# Altium project Staravia.PrjPcb
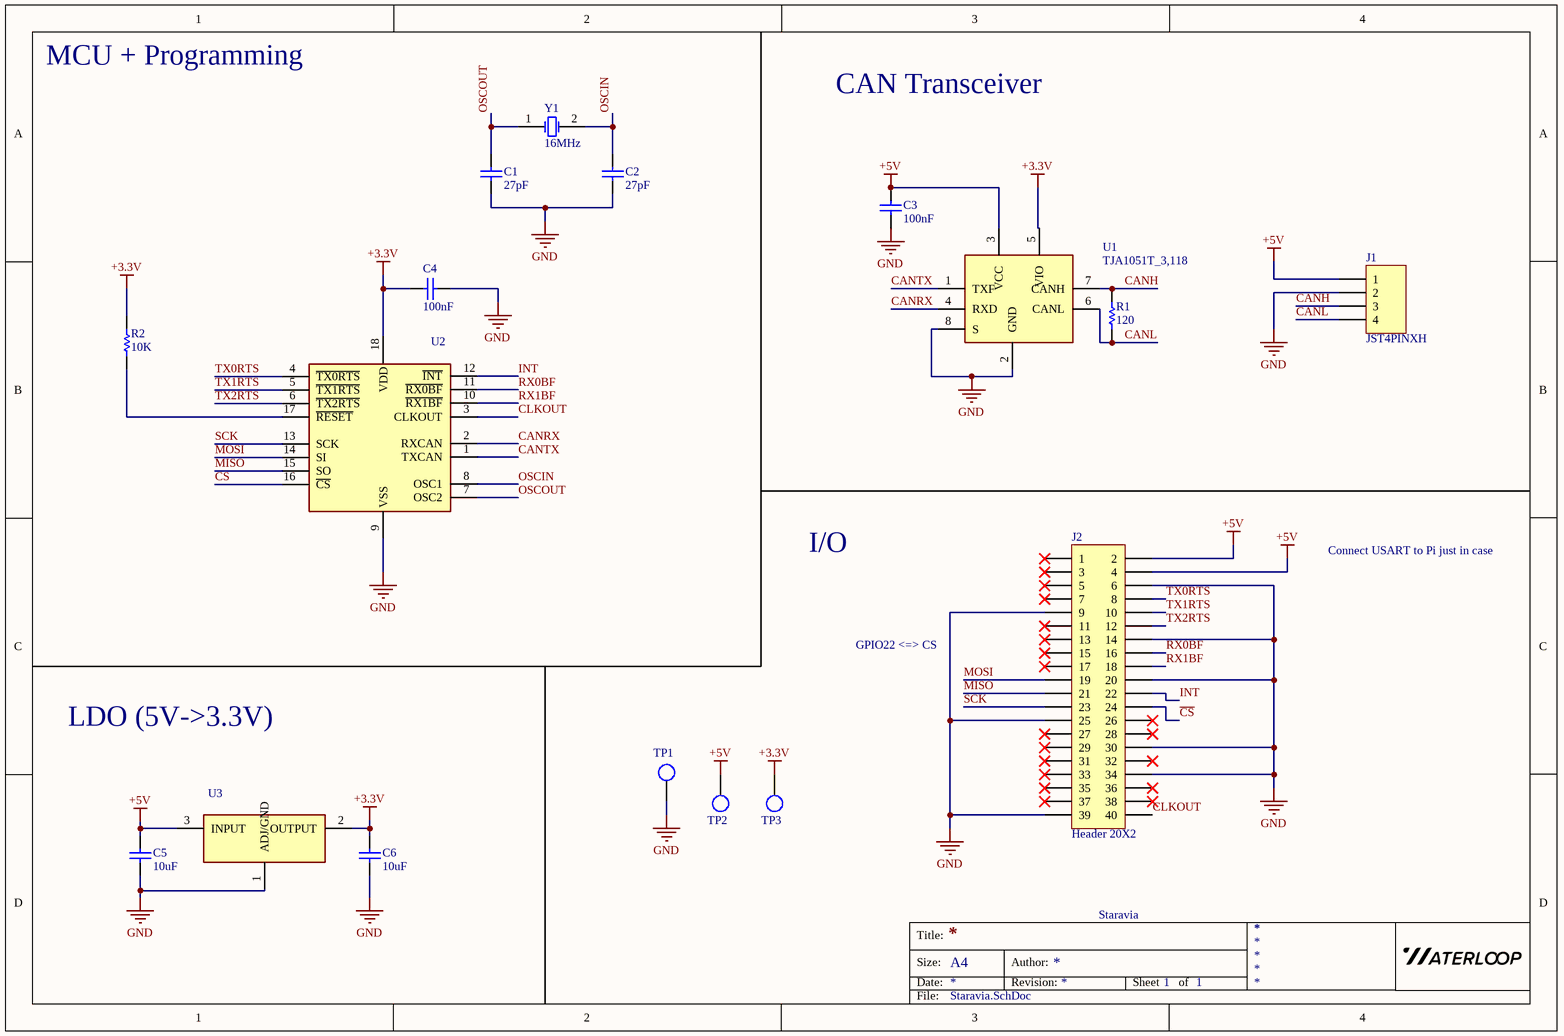
[diagram p0: Staravia.SchDoc]
1 sheet, 17 parts. Net scope: global (net labels, ports and power ports of the same name join across sheets).
Board file: Staravia.PcbDoc

## Sheet Staravia.SchDoc
size A4; SheetNumber: 1; SheetTotal: 1

### Parts
C1  value 27pF  [0805 - Capacitor]  (hidden comment: Capacitor - Nonpolarized)
C2  value 27pF  [0805 - Capacitor]  (hidden comment: Capacitor - Nonpolarized)
C3  value 100nF  [0805 - Capacitor]  (hidden comment: Capacitor - Nonpolarized)
C4  value 100nF  [0805 - Capacitor]  (hidden comment: Capacitor - Nonpolarized)
C5  value 10uF  [0805 - Capacitor]  (hidden comment: Capacitor - Nonpolarized)
C6  value 10uF  [0805 - Capacitor]  (hidden comment: Capacitor - Nonpolarized)
J1  JST4PINXH  [B4B-XH]  (no BOM)
J2  Header 20X2  [HDR2X20]  (no BOM)
R1  value 120  [0603 - Resistor]  (hidden comment: Resistor)
R2  value 10K  [0603 - Resistor]  (hidden comment: Resistor)
TP1  Test Point  [Test Point]  (value not drawn)  (no BOM)
TP2  Test Point  [Test Point]  (value not drawn)  (no BOM)
TP3  Test Point  [Test Point]  (value not drawn)  (no BOM)
U1  TJA1051T_3,118  [TJA1051T/3,118]  (no BOM)
U2  MCP2515-E/SO  [MCP2515-I/ML]  (value not drawn)
U3  TLV1117-33IDCYR  [TLV1117]  (value not drawn)  (no BOM)
Y1  value 16MHz  [2-SMD NO LEAD CRSYSTAL]  (hidden comment: Oscillator)

### Nets
+3.3V: C4.2 C6.2 R2.2 TP3.1 U1.5(VIO) U2.18(VDD) U3.2(OUTPUT)
+5V: C3.2 C5.1 J1.1 J2.2 J2.4 TP2.1 U1.3(VCC) U3.3(INPUT)
GND: C1.1 C2.1 C3.1 C4.1 C5.2 C6.1 J1.2 J2.6 J2.9 J2.14 J2.20 J2.25 J2.30 J2.34 J2.39 TP1.1 U1.2(GND) U1.8(S) U2.9(VSS) U3.1(ADJ/GND)
~{CS}: J2.24 U2.16(~{CS})
CANH: J1.3 R1.2 U1.7(CANH)
CANL: J1.4 R1.1 U1.6(CANL)
CANRX: U1.4(RXD) U2.2(RXCAN)
CANTX: U1.1(TXF) U2.1(TXCAN)
CLKOUT: J2.40 U2.3(CLKOUT)
INT: J2.22 U2.12(~{INT})
MISO: J2.21 U2.15(SO)
MOSI: J2.19 U2.14(SI)
OSCIN: C2.2 U2.8(OSC1) Y1.2(OSC2)
OSCOUT: C1.2 U2.7(OSC2) Y1.1(OSC1)
RX0BF: J2.16 U2.11(~{RX0BF})
RX1BF: J2.18 U2.10(~{RX1BF})
SCK: J2.23 U2.13(SCK)
TX0RTS: J2.8 U2.4(~{TX0RTS})
TX1RTS: J2.10 U2.5(~{TX1RTS})
TX2RTS: J2.12 U2.6(~{TX2RTS})
NetR2_1: R2.1 U2.17(~{RESET})

Not connected (* = marked no-connect by the designer): J2 1* 3* 5* 7* 11* 13* 15* 17* 26* 27* 28* 29* 31* 32* 33* 35* 36* 37* 38*

### Notes on the sheet
- MCU + Programming
- CAN Transceiver
- I/O
- Connect USART to Pi just in case
- GPIO22 <=> CS
- LDO (5V->3.3V)
- Staravia
- Title:
- Size:
- Date:
- A4
- Author:
- Revision:
- Sheet
- of
- File:

### Library data of the parts
C1 C2 = Capacitor - Nonpolarized: Nonpolarized Capacitor; Manufacturer: Yageo; Manufacturer Part Number: CC0805JRNPO9BN270; Supplier Part Number: 311-1104-1-ND; Supplier: Digikey; Rating: *
C3 C4 = Capacitor - Nonpolarized: Nonpolarized Capacitor; Manufacturer: Yageo; Manufacturer Part Number: CC0805KRX7R8BB104; Supplier Part Number: 311-1141-1-ND; Supplier: Digikey; Rating: *
C5 C6 = Capacitor - Nonpolarized: Nonpolarized Capacitor; Manufacturer: Yageo; Manufacturer Part Number: CC0805KFX7R6BB106; Supplier Part Number: 13-CC0805KFX7R6BB106CT-ND; Supplier: Digikey; Rating: *
J1 = 1x4 Header: 1x4 Pin Header
J2 = Header 20X2: Header, 20-Pin, Dual row; LatestRevisionDate: 17-Jul-2002; LatestRevisionNote: Re-released for DXP Platform.; Publisher: Altium Limited
R1 = Resistor: Manufacturer Part Number: RC0603FR-07120RL; Manufacturer: Yageo; Supplier Part Number: 311-120HRCT-ND; Supplier: Digikey
R2 = Resistor: Manufacturer Part Number: RC0603FR-0710KL; Manufacturer: Yageo; Rating: *; Supplier Part Number: 311-10.0KHRCT-ND; Supplier: Digikey
U1 = TJA1051T_3,118: CAN Transceiver IC 4.5V-5.5V 250ns; Manufacturer: NXP; Datasheet: http://www.nxp.com/docs/en/data-sheet/TJA1051.pdf; Manufacturer Part Number: TJA1051T/3,118; Supplier Part Number: 568-8684-1-ND; Supplier: Digikey; ComponentLink1Description: Datasheet; ComponentLink1URL: http://www.nxp.com/docs/en/data-sheet/TJA1051.pdf
U2 = MCP2515-E/SO: SPI->CAN Controller; Manufacturer: Microchip; Manufacturer Part Number: MCP2515-E/SO; Supplier Part Number: MCP2515-E/SO-ND; Supplier: Digikey; ComponentLink1Description: Datasheet; ComponentLink1URL: https://ww1.microchip.com/downloads/en/DeviceDoc/MCP2515-Stand-Alone-CAN-Controller-with-SPI-20001801J.pdf
U3 = TLV1117-33IDCYR: Linear Voltage Regulator IC 3.3V 800MA SOT223-4; Manufacturer: Texas Instruments; Manufacturer Part Number: TLV1117-33IDCYR; Supplier Part Number: 296-21112-1-ND; Supplier: Digikey; ComponentLink1Description: Datasheet; ComponentLink1URL: http://www.ti.com/lit/ds/symlink/tlv1117.pdf?HQS=TI-null-null-digikeymode-df-pf-null-wwe&ts=1590668900314
Y1 = Oscillator: Crystal Oscillator; Manufacturer Part Number: ABM7-16.000MHZ-4-T; Manufacturer: Abracon LLC; Supplier Part Number: 535-13460-1-ND; Supplier: Digikey; Rating: *